# EAGLE design pcb1a (EAGLE 9.6.2)
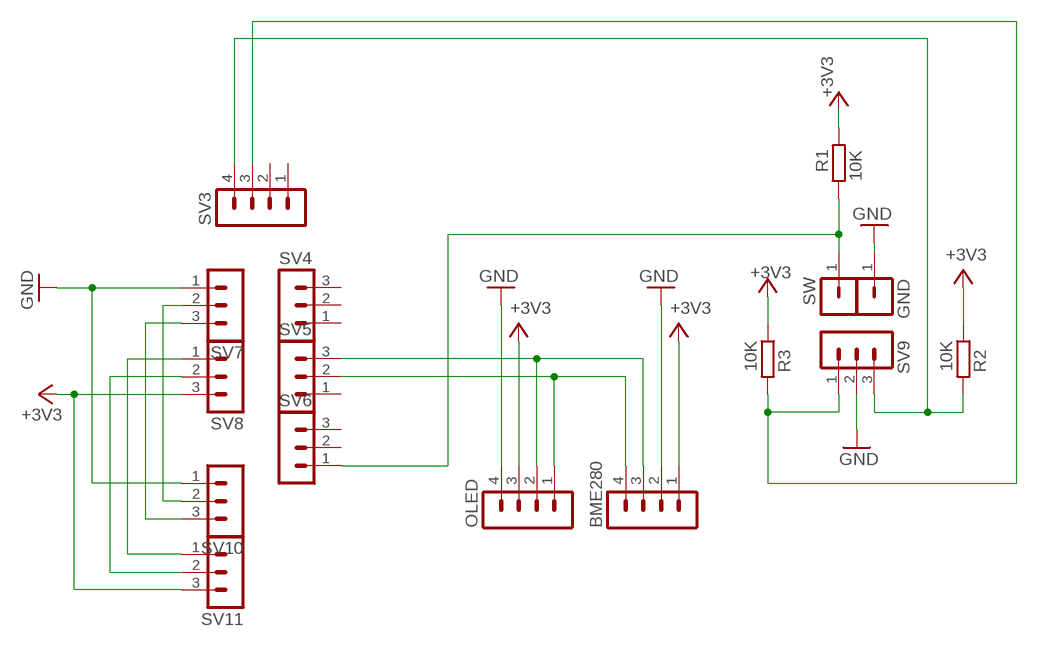
[diagram p0: schematic, sheet 1]

## Parts
BME280  PINHEAD-MA04-1  [PINHEAD-MA04-1]
GND  PINHEAD-MA01-1  [PINHEAD-MA01-1]
OLED  PINHEAD-MA04-1  [PINHEAD-MA04-1]
R1  10K  R-EU_0204/5  [0204/5]
R2  10K  R-EU_0204/5  [0204/5]
R3  10K  R-EU_0204/5  [0204/5]
SV3  PINHEAD-MA04-1  [PINHEAD-MA04-1]
SV4  PINHEAD-MA03-1  [PINHEAD-MA03-1]
SV5  PINHEAD-MA03-1  [PINHEAD-MA03-1]
SV6  PINHEAD-MA03-1  [PINHEAD-MA03-1]
SV7  PINHEAD-MA03-1  [PINHEAD-MA03-1]
SV8  PINHEAD-MA03-1  [PINHEAD-MA03-1]
SV9  PINHEAD-MA03-1  [PINHEAD-MA03-1]
SV10  PINHEAD-MA03-1  [PINHEAD-MA03-1]
SV11  PINHEAD-MA03-1  [PINHEAD-MA03-1]
SW  PINHEAD-MA01-1  [PINHEAD-MA01-1]

## Nets
+3V3: BME280.1 OLED.3 R1.2 R2.1 R3.1 SV8.3 SV11.3
GND: BME280.2 GND.1 OLED.4 SV7.1 SV9.2 SV10.1
N$1: R3.2 SV3.3 SV9.1
N$2: BME280.3 OLED.2 SV5.3
N$3: BME280.4 OLED.1 SV5.2
N$4: SV7.2 SV10.2
N$6: R2.2 SV3.4 SV9.3
N$7: SV7.3 SV10.3
N$8: SV8.1 SV11.1
N$9: SV8.2 SV11.2
N$10: R1.1 SV6.1 SW.1
Unconnected: SV3.1 SV3.2 SV4.1 SV4.2 SV4.3 SV5.1 SV6.2 SV6.3

## Library data of the parts
BME280 OLED SV3 = ytani1:PINHEAD-MA04-1: PIN HEADER; OC_FARNELL: unknown; OC_NEWARK: unknown
GND SW = ytani1:PINHEAD-MA01-1
R1-R3 = rcl:R-EU_: RESISTOR, European symbol; SPICEPREFIX: R
SV4-SV11 = ytani1:PINHEAD-MA03-1: PIN HEADER; OC_FARNELL: unknown; OC_NEWARK: unknown

## Board
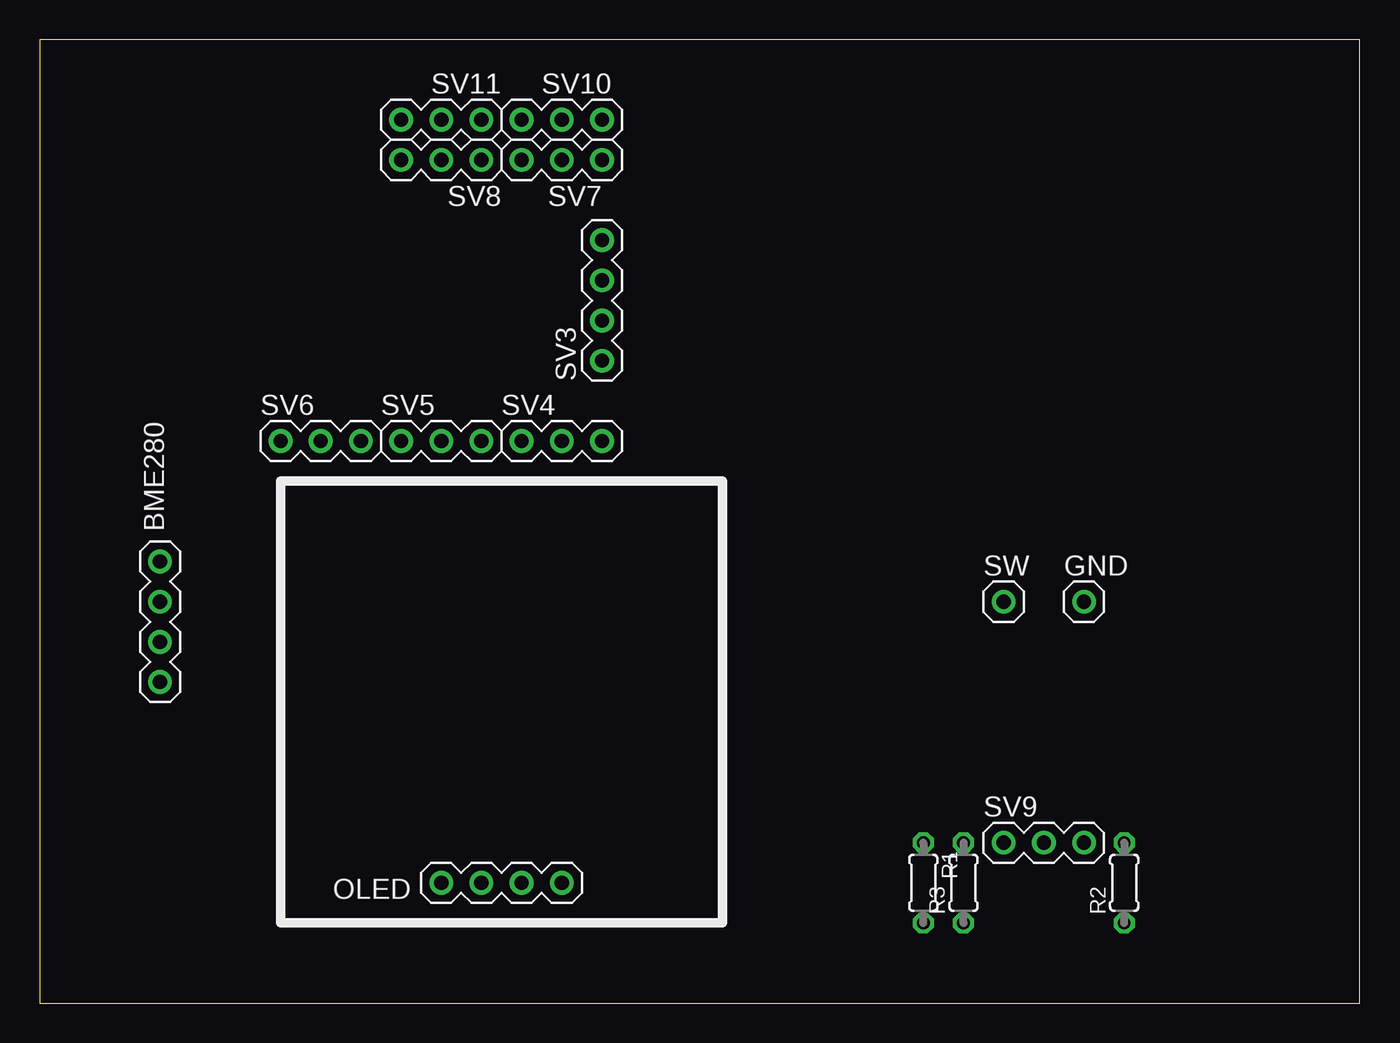
[diagram p1: board, top side]
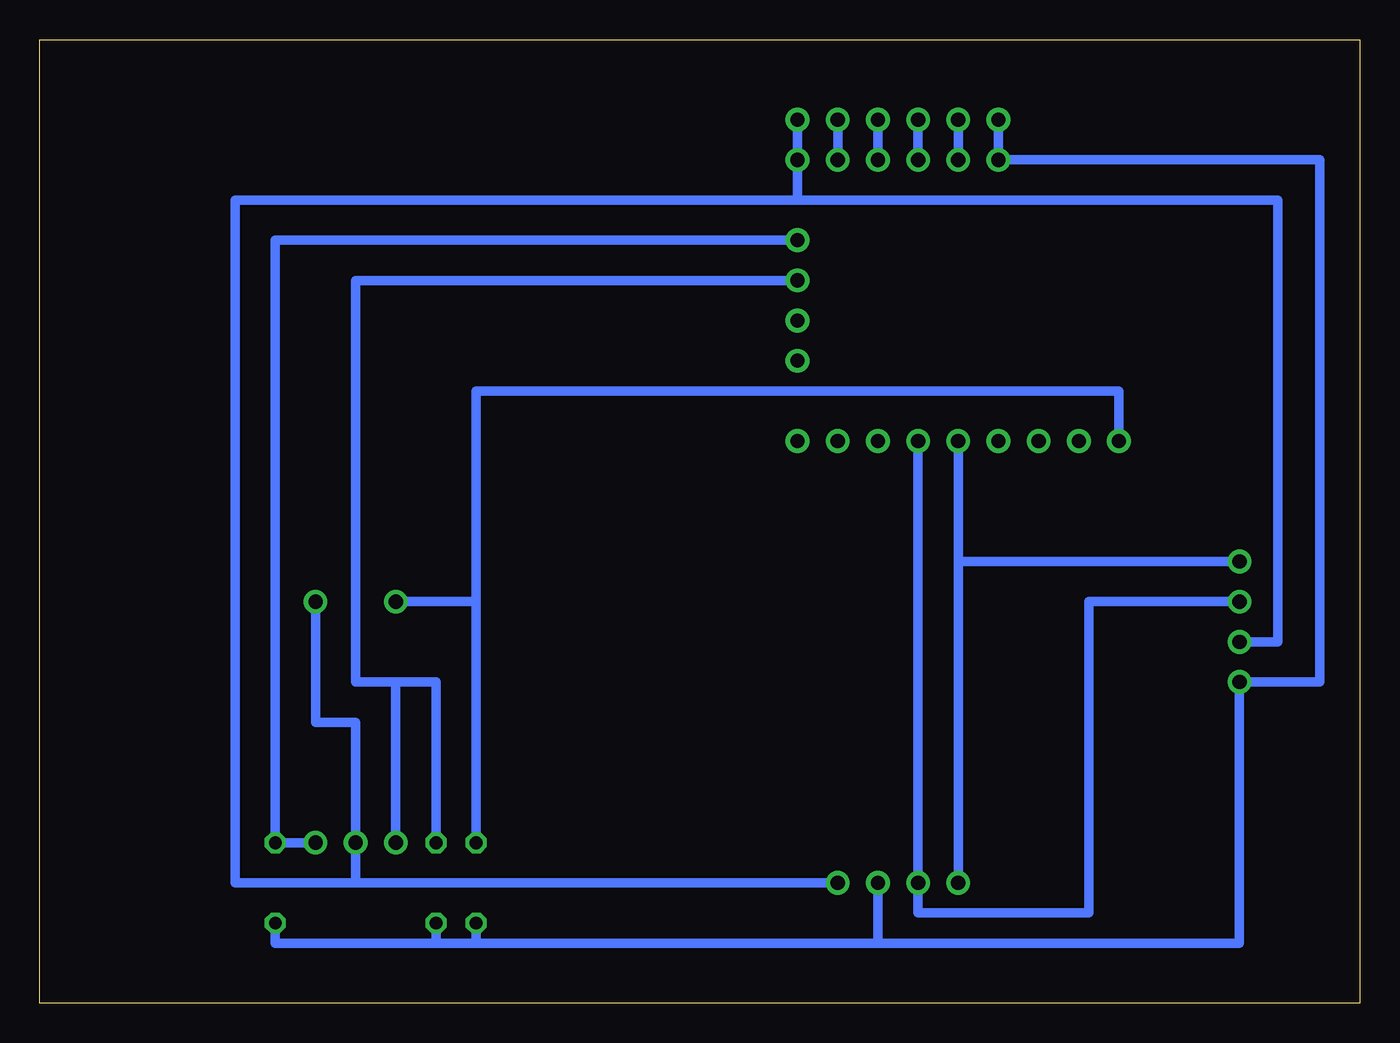
[diagram p2: board, bottom side, seen from below]

Size 83.49 x 60.95 mm. Coordinates in mm from the lower left corner, seen from the top.
Outline: 0,0 83.49,0 83.49,60.95 0,60.95 0,0
Copper layers (1*16): Top 0.035mm / dielectric 1.5mm / Bottom 0.035mm
Design rules "default": minimum track width 6mil, minimum drill 0.35mm, track to track 6mil, track to pad 6mil, pad to pad 6mil, via to via 6mil, smd to smd 6mil, copper to edge 40mil, drill to drill 6mil, minimum pad ring 10mil, minimum via ring 8mil, stop-mask expansion 4mil, vias tented up to drill 0mil, thermal gap 10mil

### Footprints (pad centres in the part's own frame; a part is rotated, then mirrored left to right if it is on the bottom)
PINHEAD-MA04-1 = drill 0.9 pad 1.5: 1 -3.81,0; 2 -1.27,0; 3 1.27,0; 4 3.81,0
PINHEAD-MA01-1 = drill 0.9 pad 1.5: 1 1.27,0
0204/5 = drill 0.813 octagon: 1 -2.54,0; 2 2.54,0
PINHEAD-MA03-1 = drill 0.9 pad 1.5: 1 -1.27,0; 2 1.27,0; 3 3.81,0

### Placement (x,y rotation side)
BME280  7.62,24.13 90 top
GND  64.77,25.4 0 top
OLED  29.21,7.62 0 top
R1  55.88,7.62 270 top
R2  68.58,7.62 90 top
R3  58.42,7.62 90 top
SV3  35.56,44.45 90 top
SV4  31.75,35.56 0 top
SV5  24.13,35.56 0 top
SV6  16.51,35.56 0 top
SV7  34.29,53.34 180 top
SV8  26.67,53.34 180 top
SV9  62.23,10.16 0 top
SV10  34.29,55.88 180 top
SV11  26.67,55.88 180 top
SW  59.69,25.4 0 top

### Tracks (layer width: path | path; a pad name or v marks a point on that pad's centre or on a via)
+3V3
  Bottom 0.61: SV11.3 SV8.3 2.54,53.34 2.54,20.32 BME280.1 7.62,3.81 30.48,3.81 | 30.48,3.81 OLED.3 | R2.1 68.58,3.81 58.42,3.81 | 55.88,3.81 30.48,3.81 | R1.2 55.88,3.81 | 55.88,3.81 58.42,3.81 | 58.42,3.81 R3.1
GND
  Bottom 0.61: SV10.1 SV7.1 35.56,50.8 | 35.56,50.8 5.21,50.8 5.21,22.86 BME280.2 | GND.1 66.04,17.78 63.5,17.78 SV9.2 63.5,7.62 | 63.5,7.62 71.12,7.62 71.12,50.8 35.56,50.8 | OLED.4 63.5,7.62
N$1
  Bottom 0.61: SV3.3 63.5,45.72 63.5,20.32 60.96,20.32 | 60.96,20.32 SV9.1 | R3.2 58.42,20.32 60.96,20.32
N$2
  Bottom 0.61: SV5.3 OLED.2 27.94,5.71 17.14,5.71 17.14,25.4 BME280.3
N$3
  Bottom 0.61: SV5.2 OLED.1 25.4,27.94 BME280.4
N$4
  Bottom 0.61: SV7.2 SV10.2
N$6
  Bottom 0.61: SV3.4 68.58,48.26 R2.2 SV9.3
N$7
  Bottom 0.61: SV7.3 SV10.3
N$8
  Bottom 0.61: SV8.1 SV11.1
N$9
  Bottom 0.61: SV8.2 SV11.2
N$10
  Bottom 0.61: SV6.1 15.24,38.73 55.88,38.73 R1.1 55.88,25.4 SW.1